# EAGLE design BuSPIrate_breakout (EAGLE 9.2.2)
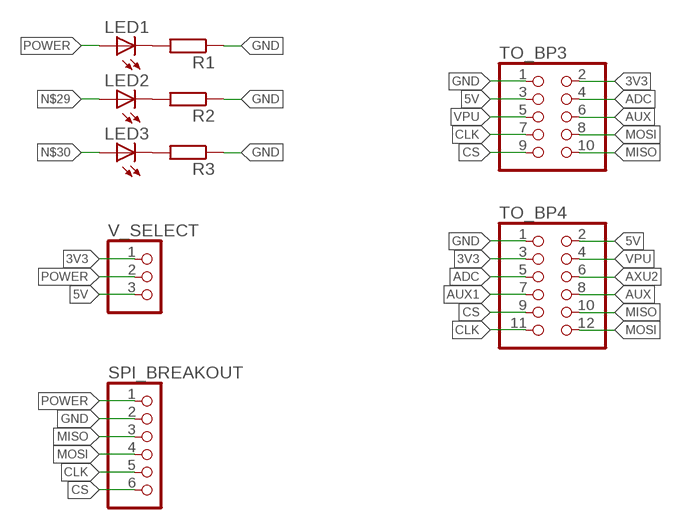
[diagram p0: schematic, sheet 1]

## Parts
LED1  LEDSML1206  [SML1206]
LED2  LEDSML1206  [SML1206]
LED3  LEDSML1206  [SML1206]
R1  R-EU_M1206  [M1206]
R2  R-EU_M1206  [M1206]
R3  R-EU_M1206  [M1206]
SPI_BREAKOUT  PINHD-1X6  [1X06]
TO_BP3  PINHD-2X5  [2X05]
TO_BP4  PINHD-2X6  [2X06]
V_SELECT  PINHD-1X3  [1X03]

## Nets
3V3: TO_BP3.2 TO_BP4.3 V_SELECT.1
5V: TO_BP3.3 TO_BP4.2 V_SELECT.3
ADC: TO_BP3.4 TO_BP4.5
AUX: TO_BP3.6 TO_BP4.8
AUX1: TO_BP4.7
AXU2: TO_BP4.6
CLK: SPI_BREAKOUT.5 TO_BP3.7 TO_BP4.11
CS: SPI_BREAKOUT.6 TO_BP3.9 TO_BP4.9
GND: R1.1 R2.1 R3.1 SPI_BREAKOUT.2 TO_BP3.1 TO_BP4.1
MISO: SPI_BREAKOUT.3 TO_BP3.10 TO_BP4.10
MOSI: SPI_BREAKOUT.4 TO_BP3.8 TO_BP4.12
N$1: LED1.C R1.2
N$2: LED2.C R2.2
N$3: LED3.C R3.2
N$29: LED2.A
N$30: LED3.A
POWER: LED1.A SPI_BREAKOUT.1 V_SELECT.2
VPU: TO_BP3.5 TO_BP4.4

## Library data of the parts
LED1-LED3 = led:LED: LED OSRAM: - CHIPLED LG R971, LG N971, LY N971, LG Q971, LY Q971, LO R971, LY R971 LH N974, LH R974 LS Q976, LO Q976, LY Q976 LO Q996 - Hyper CHIPLED LW Q18S LB Q993, LB Q99A, LB R99A - SideLED LS A670, LO A670, LY A670, LG A670, LP A670 LB A673, LV A673, LT A673, LW A673 LH A674 LY A675 LS A676, LA A676, LO A676, LY A676, LW A676 LS A679, LY A679, LG A679 - Hyper Micro SIDELED® LS Y876, LA Y876, LO Y876, LY Y876 LT Y87S - SmartLED LW L88C, LW L88S LB L89C, LB L89S, LG L890 LS L89K, LO L89K, LY L89K LS L896, LA L896, LO L896, LY L896 - TOPLED LS T670, LO T670, LY T670, LG T670, LP T670 LSG T670, LSP T670, LSY T670, LOP T670, LYG T670 LG T671, LOG T671, LSG T671 LB T673, LV T673, LT T673, LW T673 LH T674 LS T676, LA T676, LO T676, LY T676, LB T676, LH T676, LSB T676, LW T676 LB T67C, LV T67C, LT T67C, LS T67K, LO T67K, LY T67K, LW E67C LS E67B, LA E67B, LO E67B, LY E67B, LB E67C, LV E67C, LT E67C LW T67C LS T679, LY T679, LG T679 LS T770, LO T770, LY T770, LG T770, LP T770 LB T773, LV T773, LT T773, LW T773 LH T774 LS E675, LA E675, LY E675, LS T675 LS T776, LA T776, LO T776, LY T776, LB T776 LHGB T686 LT T68C, LB T68C - Hyper Mini TOPLED® LB M676 - Mini TOPLED Santana® LG M470 LS M47K, LO M47K, LY M47K Source: http://www.osram.convergy.de LUXEON: - LUMILED® LXK2-PW12-R00, LXK2-PW12-S00, LXK2-PW14-U00, LXK2-PW14-V00 LXK2-PM12-R00, LXK2-PM12-S00, LXK2-PM14-U00 LXK2-PE12-Q00, LXK2-PE12-R00, LXK2-PE12-S00, LXK2-PE14-T00, LXK2-PE14-U00 LXK2-PB12-K00, LXK2-PB12-L00, LXK2-PB12-M00, LXK2-PB14-N00, LXK2-PB14-P00, LXK2-PB14-Q00 LXK2-PR12-L00, LXK2-PR12-M00, LXK2-PR14-Q00, LXK2-PR14-R00 LXK2-PD12-Q00, LXK2-PD12-R00, LXK2-PD12-S00 LXK2-PH12-R00, LXK2-PH12-S00 LXK2-PL12-P00, LXK2-PL12-Q00, LXK2-PL12-R00 Source: www.luxeon.com KINGBRIGHT: KA-3528ASYC Source: www.kingbright.com
R1-R3 = rcl:R-EU_: RESISTOR, European symbol; SPICEPREFIX: R
SPI_BREAKOUT = pinhead:PINHD-1X6: PIN HEADER
TO_BP3 = pinhead:PINHD-2X5: PIN HEADER
TO_BP4 = pinhead:PINHD-2X6: PIN HEADER
V_SELECT = pinhead:PINHD-1X3: PIN HEADER

## Board
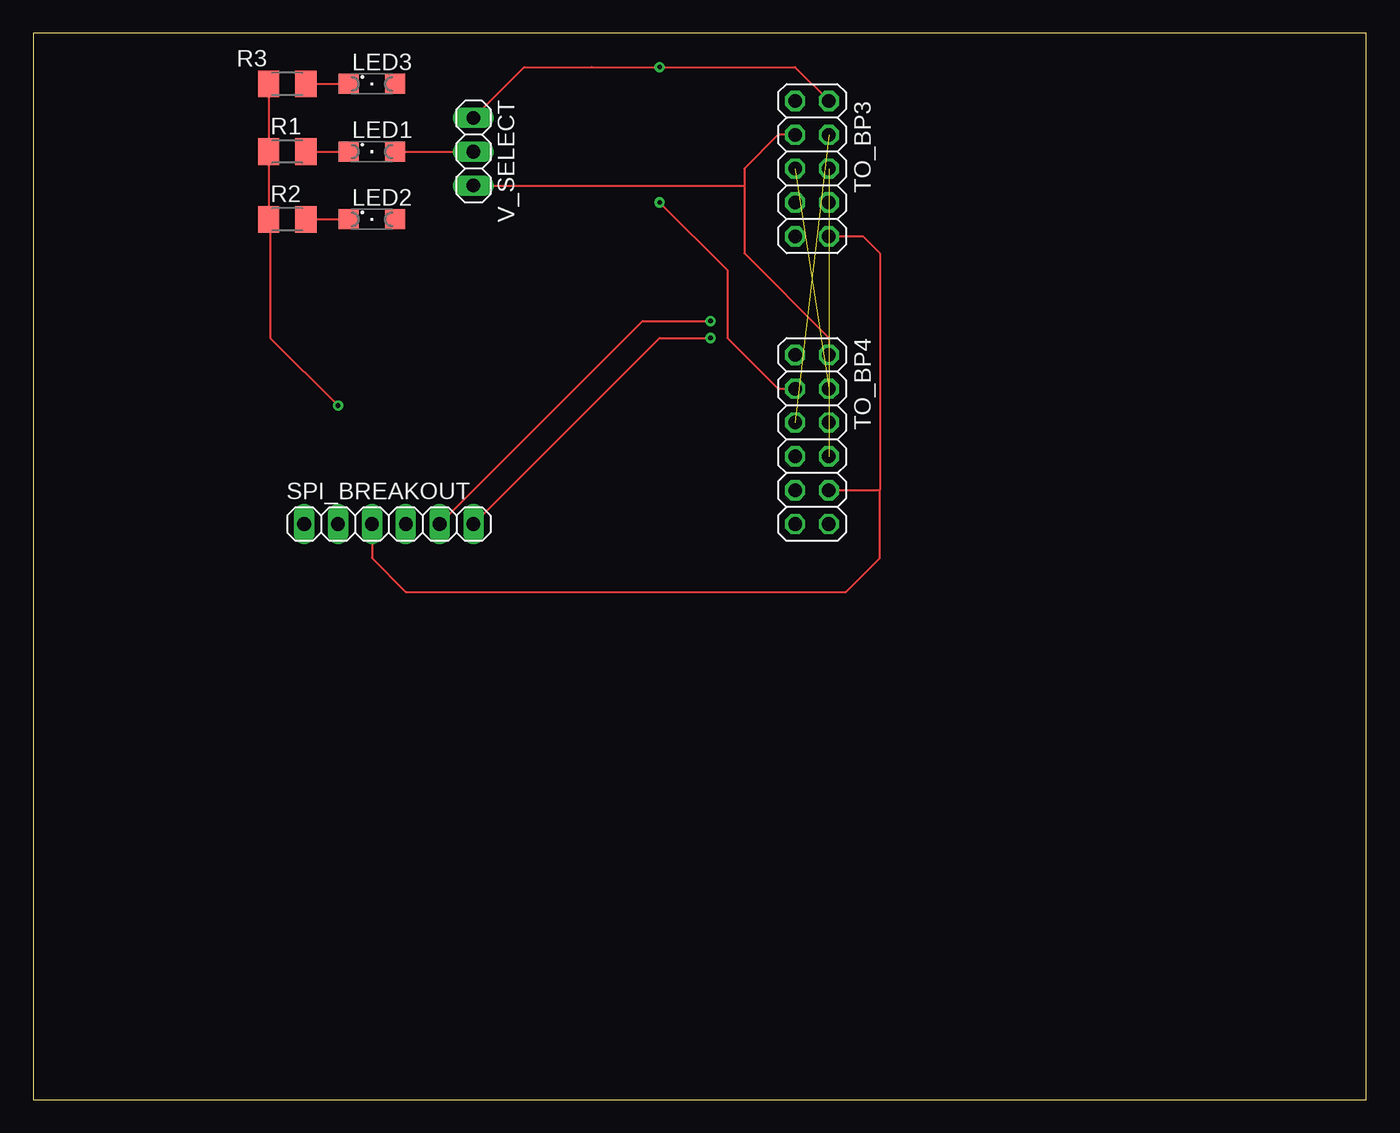
[diagram p1: board, top side]
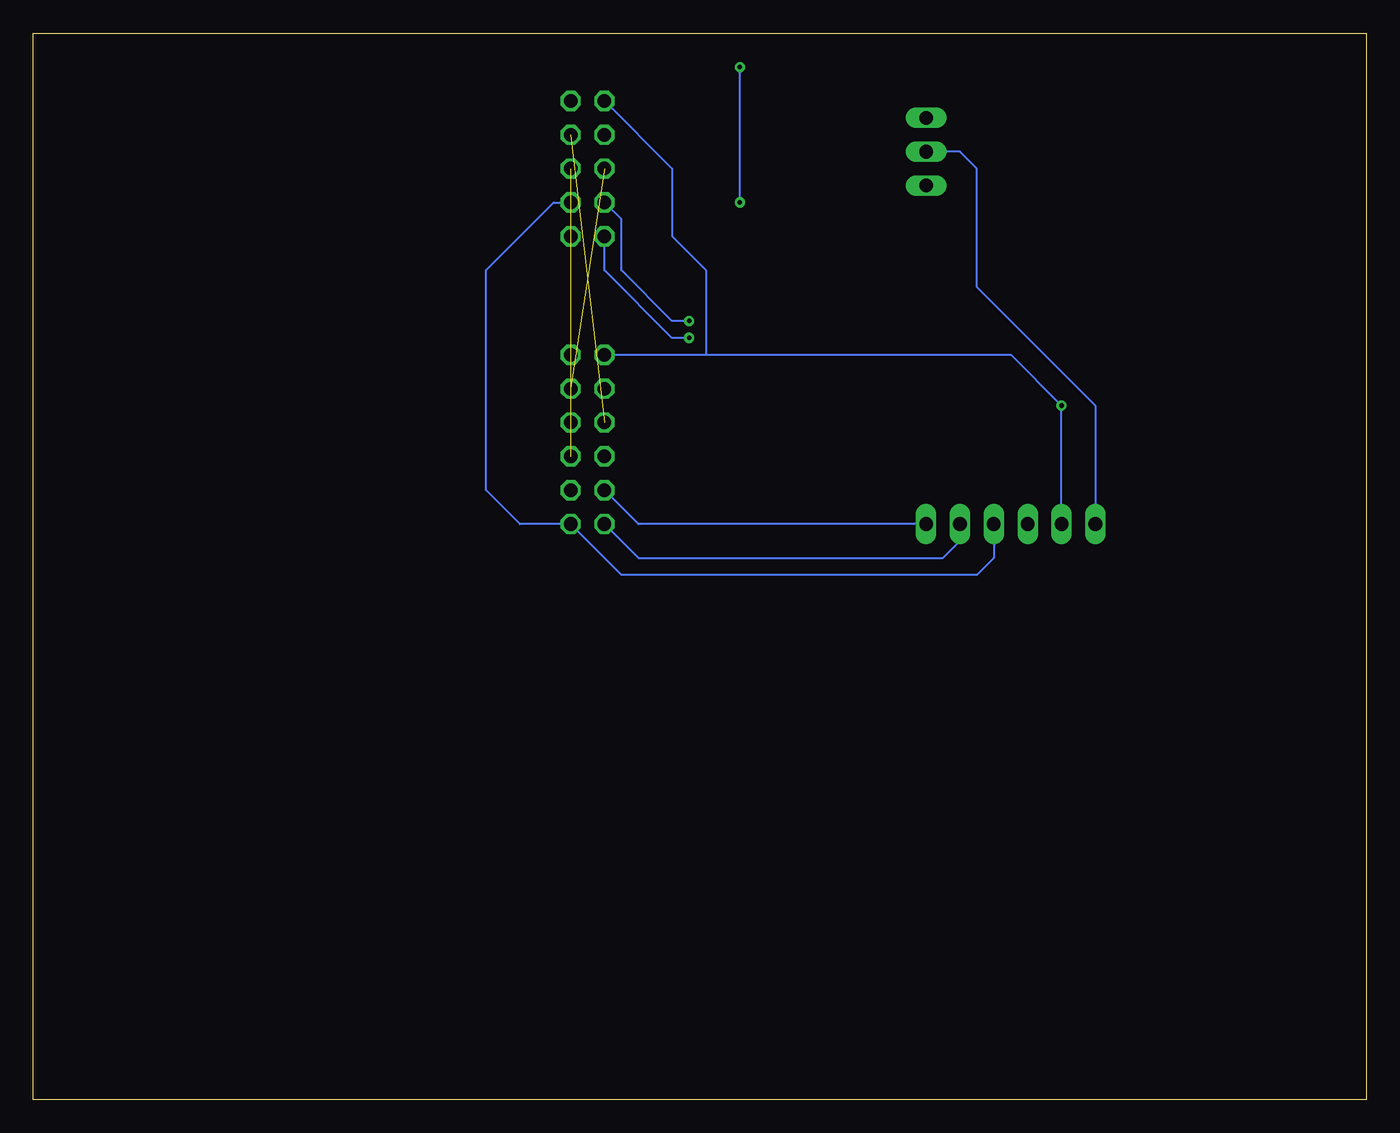
[diagram p2: board, bottom side, seen from below]

Size 100 x 80 mm. Coordinates in mm from the lower left corner, seen from the top.
Outline: 0,0 100,0 100,80 0,80 0,0
Copper layers (1*16): Top 0.035mm / dielectric 1.5mm / Bottom 0.035mm
Design rules "default": minimum track width 6mil, minimum drill 0.35mm, track to track 6mil, track to pad 6mil, pad to pad 6mil, via to via 6mil, smd to smd 6mil, copper to edge 40mil, drill to drill 6mil, minimum pad ring 10mil, minimum via ring 8mil, stop-mask expansion 4mil, vias tented up to drill 0mil, thermal gap 10mil

### Footprints (pad centres in the part's own frame; a part is rotated, then mirrored left to right if it is on the bottom)
SML1206 = smd 1.5 x 1.5: A 1.75,0; C -1.75,0
M1206 = smd 1.6 x 2: 1 -1.4,0; 2 1.4,0
1X06 = drill 1.016 long: 1 -6.35,0; 2 -3.81,0; 3 -1.27,0; 4 1.27,0; 5 3.81,0; 6 6.35,0
2X05 = drill 1.016 octagon: 1 -5.08,-1.27; 2 -5.08,1.27; 3 -2.54,-1.27; 4 -2.54,1.27; 5 0,-1.27; 6 0,1.27; 7 2.54,-1.27; 8 2.54,1.27; 9 5.08,-1.27; 10 5.08,1.27
2X06 = drill 1.016 octagon: 1 -6.35,-1.27; 2 -6.35,1.27; 3 -3.81,-1.27; 4 -3.81,1.27; 5 -1.27,-1.27; 6 -1.27,1.27; 7 1.27,-1.27; 8 1.27,1.27; 9 3.81,-1.27; 10 3.81,1.27; 11 6.35,-1.27; 12 6.35,1.27
1X03 = drill 1.016 long: 1 -2.54,0; 2 0,0; 3 2.54,0

### Placement (x,y rotation side)
LED1  25.4,71.12 0 top
LED2  25.4,66.04 0 top
LED3  25.4,76.2 0 top
R1  19.05,71.12 0 top
R2  19.05,66.04 0 top
R3  19.05,76.2 0 top
SPI_BREAKOUT  26.67,43.18 0 top
TO_BP3  58.42,69.85 270 top
TO_BP4  58.42,49.53 270 top
V_SELECT  33.02,71.12 270 top

### Tracks (layer width: path | path; a pad name or v marks a point on that pad's centre or on a via)
3V3  (via drill 0.35)
  Top 0.152: TO_BP3.2 57.15,77.47 v46.99,77.47 41.91,77.47 36.83,77.47 V_SELECT.1 | TO_BP4.3 55.88,53.34 52.07,57.15 52.07,62.23 v46.99,67.31
  Bottom 0.152: v46.99,67.31 v46.99,77.47
5V
  Top 0.152: TO_BP4.2 59.69,57.15 53.34,63.5 53.34,68.58 | TO_BP3.3 55.88,72.39 53.34,69.85 53.34,68.58 | V_SELECT.3 53.34,68.58
ADC  (1 unrouted)
AUX  (1 unrouted)
CLK  (via drill 0.35)
  Top 0.152: v50.8,58.42 45.72,58.42 SPI_BREAKOUT.5
  Bottom 0.152: TO_BP4.11 54.61,40.64 31.75,40.64 30.48,41.91 SPI_BREAKOUT.5 | v50.8,58.42 52.07,58.42 55.88,62.23 55.88,66.04 TO_BP3.7
CS  (via drill 0.35)
  Top 0.152: SPI_BREAKOUT.6 46.99,57.15 v50.8,57.15
  Bottom 0.152: SPI_BREAKOUT.6 54.61,43.18 TO_BP4.9 | v50.8,57.15 52.07,57.15 57.15,62.23 TO_BP3.9
GND  (via drill 0.35)
  Top 0.152: R3.1 R1.1 R2.1 17.78,65.91 17.78,57.15 v22.86,52.07
  Bottom 0.152: TO_BP4.1 49.53,55.88 | TO_BP3.1 52.07,69.85 52.07,64.77 49.53,62.23 49.53,55.88 | 49.53,55.88 26.67,55.88 v22.86,52.07 SPI_BREAKOUT.2
MISO
  Top 0.152: SPI_BREAKOUT.3 25.4,40.64 27.94,38.1 60.96,38.1 63.5,40.64 63.5,45.72 | TO_BP3.10 62.23,64.77 63.5,63.5 63.5,45.72 | TO_BP4.10 63.5,45.72
MOSI
  Bottom 0.152: SPI_BREAKOUT.4 27.94,40.64 29.21,39.37 55.88,39.37 TO_BP4.12 63.5,43.18 66.04,45.72 66.04,62.23 60.96,67.31 TO_BP3.8
N$1
  Top 0.152: R1.2 LED1.C
N$2
  Top 0.152: R2.2 LED2.C
N$3
  Top 0.152: R3.2 LED3.C
POWER
  Top 0.152: LED1.A V_SELECT.2
  Bottom 0.152: SPI_BREAKOUT.1 20.32,52.07 29.21,60.96 29.21,69.85 30.48,71.12 V_SELECT.2
VPU  (1 unrouted)